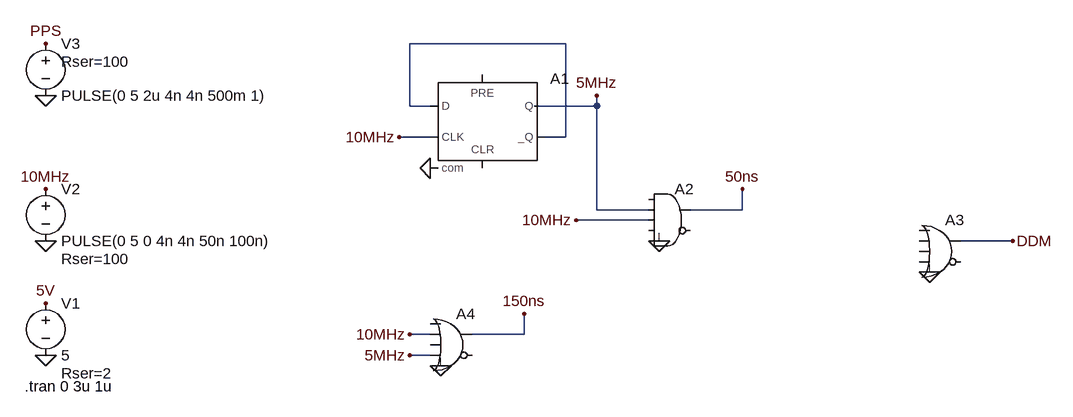
[diagram p0: schematic ddm_circuit.asc]
ddm_circuit.asc, the LTspice schematic file:
Version 4
SHEET 1 1672 680
WIRE 32 -128 -208 -128
WIRE -208 -32 -208 -128
WIRE -176 -32 -208 -32
WIRE 80 -32 80 -48
WIRE 80 -32 -16 -32
WIRE -176 16 -224 16
WIRE 32 16 32 -128
WIRE 32 16 0 16
WIRE 80 128 80 -32
WIRE 160 128 80 128
WIRE 304 128 304 96
WIRE 304 128 224 128
WIRE 160 144 48 144
WIRE 720 176 640 176
WIRE -176 320 -208 320
WIRE -32 320 -32 288
WIRE -32 320 -112 320
WIRE -176 352 -208 352
FLAG -768 176 0
FLAG -768 352 0
FLAG -768 -48 0
FLAG -768 -128 PPS
FLAG -768 96 10MHz
FLAG -768 272 5V
FLAG -176 64 0
FLAG -224 16 10MHz
FLAG 80 -48 5MHz
FLAG 176 176 0
FLAG 48 144 10MHz
FLAG 720 176 DDM
FLAG 592 224 0
FLAG -160 368 0
FLAG -208 320 10MHz
FLAG -208 352 5MHz
FLAG 304 96 50ns
FLAG -32 288 150ns
SYMBOL voltage -768 256 R0
WINDOW 123 0 0 Left 0
WINDOW 39 24 124 Left 2
SYMATTR SpiceLine Rser=2
SYMATTR InstName V1
SYMATTR Value 5
SYMBOL voltage -768 80 R0
WINDOW 123 0 0 Left 0
WINDOW 39 24 124 Left 2
SYMATTR SpiceLine Rser=100
SYMATTR InstName V2
SYMATTR Value PULSE(0 5 0 4n 4n 50n 100n)
SYMBOL voltage -768 -144 R0
WINDOW 123 0 0 Left 0
WINDOW 39 24 44 Left 2
SYMATTR SpiceLine Rser=100
SYMATTR InstName V3
SYMATTR Value PULSE(0 5 2u 4n 4n 500m 1)
SYMBOL Digital\\dflop -96 -80 R0
WINDOW 3 0 0 Invisible 0
SYMATTR Value Vlow=0 Vhigh=5 Td=4n
SYMATTR InstName A1
SYMBOL Digital\\and 192 80 R0
SYMATTR InstName A2
SYMATTR Value2 Vlow=0 Vhigh=5 Td=5n
SYMBOL Digital\\or 608 128 R0
SYMATTR InstName A3
SYMATTR Value2 Vlow=0 Vhigh=5 Td=5n
SYMBOL Digital\\or -144 272 R0
SYMATTR InstName A4
SYMATTR Value2 Vlow=0 Vhigh=5 Td=5n
TEXT -800 400 Left 2 !.tran 0 3u 1u

The netlist it stands for:
* ddm_circuit.asc
V1 5V 0 5 Rser=2
V2 10MHz 0 PULSE(0 5 0 4n 4n 50n 100n) Rser=100
V3 PPS 0 PULSE(0 5 2u 4n 4n 500m 1) Rser=100
A1 N001 0 10MHz 0 0 N001 5MHz 0 DFLOP Vlow=0 Vhigh=5 Td=4n
A2 0 5MHz 10MHz 0 0 0 50ns 0 AND Vlow=0 Vhigh=5 Td=5n
A3 0 0 0 0 0 0 DDM 0 OR Vlow=0 Vhigh=5 Td=5n
A4 0 10MHz 0 5MHz 0 0 150ns 0 OR Vlow=0 Vhigh=5 Td=5n
.tran 0 3u 1u
.backanno
.end